# Altium schematic sheet Main.SchDoc
size A4; SheetNumber: 1; SheetTotal: 7
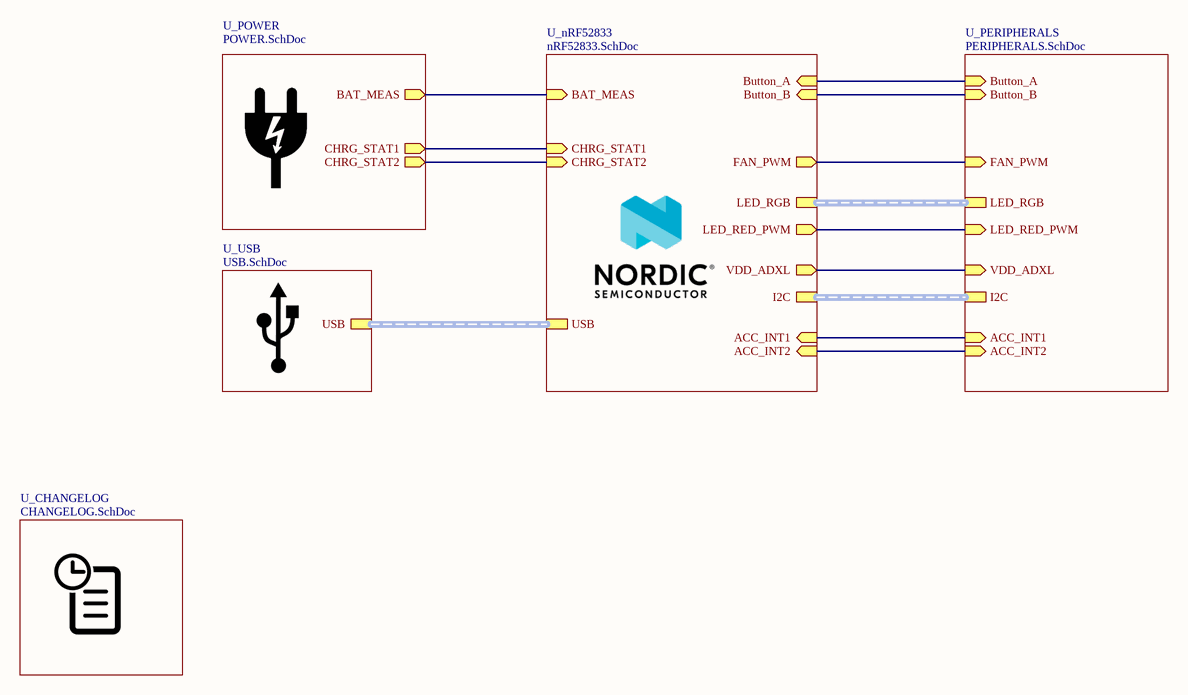
[diagram p0: Main.SchDoc]

## Sub-sheets
U_CHANGELOG = CHANGELOG.SchDoc: no entries
U_nRF52833 = nRF52833.SchDoc: I2C (harness I2C), LED_RGB (harness LED_RGB), Button_A (in), Button_B (in), FAN_PWM (out), ACC_INT1 (in), ACC_INT2 (in), CHRG_STAT1 (in), CHRG_STAT2 (in), BAT_MEAS (in), USB (harness USB), VDD_ADXL (out), LED_RED_PWM (out)
U_PERIPHERALS = PERIPHERALS.SchDoc: Button_A (in), Button_B (in), I2C (harness I2C), LED_RGB (harness LED_RGB), ACC_INT1 (in), ACC_INT2 (in), FAN_PWM (in), VDD_ADXL (in), LED_RED_PWM (in)
U_POWER = POWER.SchDoc: CHRG_STAT1 (out), CHRG_STAT2 (out), BAT_MEAS (out)
U_USB = USB.SchDoc: USB (harness USB)

## Nets
(unnamed): sheet U_nRF52833/Button_A, sheet U_PERIPHERALS/Button_A
(unnamed): sheet U_nRF52833/Button_B, sheet U_PERIPHERALS/Button_B
(unnamed): sheet U_nRF52833/FAN_PWM, sheet U_PERIPHERALS/FAN_PWM
(unnamed): sheet U_nRF52833/ACC_INT1, sheet U_PERIPHERALS/ACC_INT1
(unnamed): sheet U_nRF52833/ACC_INT2, sheet U_PERIPHERALS/ACC_INT2
(unnamed): sheet U_nRF52833/CHRG_STAT1, sheet U_POWER/CHRG_STAT1
(unnamed): sheet U_nRF52833/CHRG_STAT2, sheet U_POWER/CHRG_STAT2
(unnamed): sheet U_nRF52833/BAT_MEAS, sheet U_POWER/BAT_MEAS
(unnamed): sheet U_nRF52833/VDD_ADXL, sheet U_PERIPHERALS/VDD_ADXL
(unnamed): sheet U_nRF52833/LED_RED_PWM, sheet U_PERIPHERALS/LED_RED_PWM

## Buses and harness runs
harness sheet U_nRF52833/I2C = sheet U_PERIPHERALS/I2C
harness sheet U_nRF52833/LED_RGB = sheet U_PERIPHERALS/LED_RGB
harness sheet U_nRF52833/USB = sheet U_USB/USB

## Notes on the sheet
- Title:
- Sheet:
- of
- Author:
- Model:
- Document Number:
- Checked by:
- Iss-Rev:
- Approved by:
- Date:
- File name: